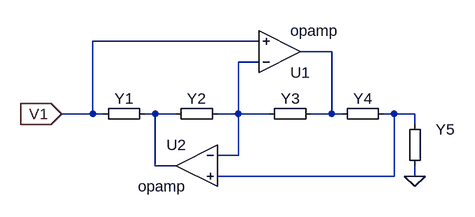
[diagram p0: schematic GIC dibujo.asc]
GIC dibujo.asc, the LTspice schematic file:
Version 4
SHEET 1 880 680
WIRE 96 48 -160 48
WIRE 208 64 160 64
WIRE 96 80 64 80
WIRE -160 160 -160 48
WIRE -160 160 -208 160
WIRE -144 160 -160 160
WIRE -64 160 -80 160
WIRE -32 160 -64 160
WIRE 64 160 64 80
WIRE 64 160 32 160
WIRE 112 160 64 160
WIRE 208 160 208 64
WIRE 208 160 176 160
WIRE 224 160 208 160
WIRE 304 160 288 160
WIRE 336 160 304 160
WIRE 336 176 336 160
WIRE 64 224 64 160
WIRE 64 224 32 224
WIRE -64 240 -64 160
WIRE -32 240 -64 240
WIRE 304 256 304 160
WIRE 304 256 32 256
WIRE 336 256 336 240
FLAG 336 256 0
FLAG -208 160 V1
IOPIN -208 160 In
SYMBOL OpAmps\\opamp 128 128 M180
SYMATTR InstName U1
SYMBOL OpAmps\\opamp 0 176 M0
SYMATTR InstName U2
SYMBOL impedancia -80 144 R90
WINDOW 0 8 32 VBottom 2
WINDOW 3 24 32 VTop 2
SYMATTR InstName Y1
SYMATTR Value ""
SYMATTR Prefix Y
SYMBOL impedancia 32 144 R90
WINDOW 0 8 32 VBottom 2
WINDOW 3 24 32 VTop 2
SYMATTR InstName Y2
SYMATTR Value ""
SYMATTR Prefix Y
SYMBOL impedancia 176 144 R90
WINDOW 0 8 32 VBottom 2
WINDOW 3 24 32 VTop 2
SYMATTR InstName Y3
SYMATTR Value ""
SYMATTR Prefix Y
SYMBOL impedancia 288 144 R90
WINDOW 0 8 32 VBottom 2
WINDOW 3 24 32 VTop 2
SYMATTR InstName Y4
SYMATTR Value ""
SYMATTR Prefix Y
SYMBOL impedancia 320 176 R0
SYMATTR InstName Y5
SYMATTR Value ""
SYMATTR Prefix Y

The netlist it stands for:
* GIC dibujo.asc
XU1 N002 V1 N001 opamp Aol=100K GBW=10Meg  ; pins invin noninvin out
XU2 N002 N004 N003 opamp Aol=100K GBW=10Meg  ; pins invin noninvin out
Y1 N003 V1
Y2 N002 N003
Y3 N001 N002
Y4 N004 N001
Y5 N004 0
.backanno
.end